# Altium schematic sheet SCHEMATIC.SchDoc
size A
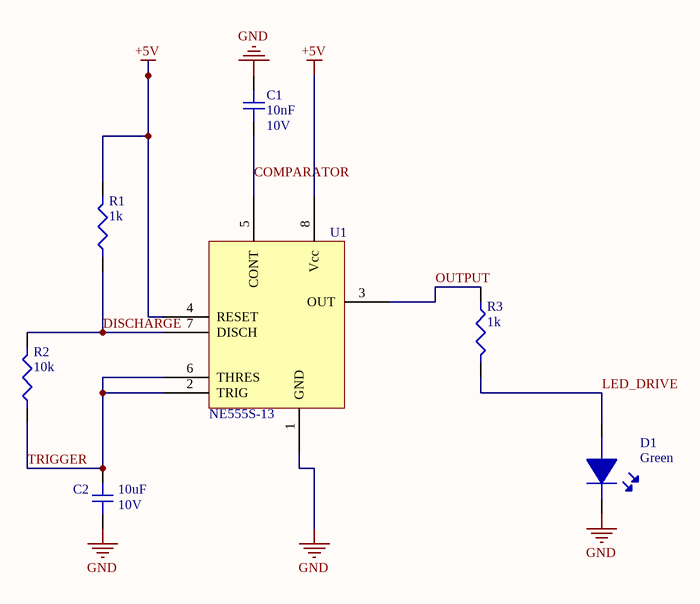
[diagram p0: SCHEMATIC.SchDoc]

## Parts
C1  10nF  Voltage Rating: 10V  [C0603]
C2  10uF  Voltage: 10V  [C0603]
D1  Green  [LED_0603]
R1  1k  [R0603]
R2  10k  [R0603]
R3  1k  [R0603]
U1  NE555S-13  [SOIC8]

## Nets
+5V: R1.2 U1.4(RESET) U1.8(Vcc)
GND: C1.2 C2.2 D1.2 U1.1(GND)
COMPARATOR: C1.1 U1.5(CONT)
DISCHARGE: R1.1 R2.2 U1.7(DISCH)
LED_DRIVE: D1.1 R3.2
OUTPUT: R3.1 U1.3(OUT)
TRIGGER: C2.1 R2.1 U1.2(TRIG) U1.6(THRES)

## Library data of the parts
C1 = CC0603KRX7R6BB103: Cap Ceramic 0.01uF 10V X7R 10% SMD 0603 125C Paper T/R; Manufacturer: Yageo; Supplier 1: Mouser; Manufacturer Part Number: CC0603KRX7R6BB103; Stock 1: 25849; Pricing 1: 1=0.1, 10=0.039, 50=0.039, 100=0.018, 1000=0.014, 10000=0.01 (USD); Mount: Surface Mount; Case/Package: 0603; Min Operating Temperature: -55°C; Max Operating Temperature: 125°C; Capacitance: 10nF; Voltage Rating (DC): 10V; Tolerance: 10%; Packaging: Tape and Reel; Dielectric: X7R; Composition: Ceramic; Length: 0.063inch; Height: 0.8mm; Width: 0.031inch; Thickness: 0.035inch; Depth: 0.8mm; Radiation Hardening: No; Lead Free: Lead Free; Halogen Free: Halogen Free; ComponentLink1URL: http://www.yageo.com/documents/recent/UPY-GPHC_X7R_6.3V-to-50V_8.pdf; ComponentLink1Description: http://www.yageo.com/documents/recent/UPY-GPHC_X7R_6.3V-to-50V_8.pdf; Supplier Part Number 1: 603-CC603KRX7R6BB103
C2 = GRM188R61A106KE69D: Cap Ceramic 10uF 10V X5R 10% SMD 0603 85C Paper T/R; Manufacturer: Murata; Supplier 1: Mouser; Manufacturer Part Number: GRM188R61A106KE69D; Stock 1: 423419; Pricing 1: 1=0.26, 10=0.17, 50=0.17, 100=0.086, 1000=0.052, 10000=0.04 (USD); Mount: Surface Mount; Case/Package: 0603; Case Code (Metric): 1608; Case Code (Imperial): 0603; Min Operating Temperature: -55°C; Max Operating Temperature: 85°C; Capacitance: 10uF; Tolerance: 10%; Packaging: Tape and Reel; Dielectric: X5R; Voltage Rating: 10V; Voltage Rating (DC): 10V; Length: 1.6mm; Height: 0.8mm; Width: 0.031inch; Thickness: 0.037inch; Depth: 0.8mm; REACH SVHC: No SVHC; Lead Free: Lead Free; Supplier Part Number 1: 81-GRM188R61A106KE9D
D1 = LTST-C190GKT: LED GREEN CLEAR 0603 SMD; Manufacturer: Vishay Lite-On; Lens Color: Clear,Colorless; Luminous Intensity: 6mcd; Forward Voltage: 2.1V; Viewing Angle: 130°; Lens Style: Clear,Colorless,Diffused,Rectangular; Forward Current: 30mA; Power Rating: 100mW; Dominant Wavelength: 569nm; Test Current: 10mA; Number of Elements: 1; Wavelength: 565nm; Voltage: 2V; Reverse Voltage: 5V; Current: 1A; Supplier 1: Digi-Key; Manufacturer Part Number: LTST-C190GKT; Stock 1: 2254042; Pricing 1: 1=0.27, 10=0.196, 25=0.1448, 100=0.1034, 250=0.07032, 500=0.06204, 1000=0.0486 (USD); Mount: Surface Mount; Case/Package: 0603; Number of Pins: 2; Color: Green; Case Code (Metric): 1608; Case Code (Imperial): 0603; Min Operating Temperature: -55°C; Max Operating Temperature: 85°C; Package Quantity: 1; Packaging: Tape and Reel; Illumination Color: Green; Lens Transparency: Clear; Power Dissipation: 100mW; Number of LEDs: 1; Length: 1.6mm; Height: 0.8mm; Width: 0.8mm; Depth: 0.8mm; Radiation Hardening: No; Lead Free: Lead Free; ComponentLink1URL: http://uk.rs-online.com/webdocs/0dc0/0900766b80dc02a6.pdf; ComponentLink1Description: http://uk.rs-online.com/webdocs/0dc0/0900766b80dc02a6.pdf; ComponentLink2URL: https://media.digikey.com/pdf/Data%20Sheets/Lite-On%20PDFs/LTST-C190GKT.pdf; ComponentLink2Description: https://media.digikey.com/pdf/Data%20Sheets/Lite-On%20PDFs/LTST-C190GKT.pdf; ComponentLink3URL: http://www1.futureelectronics.com/doc/LITE%20ON/LITE-ON%20LTST-C190GKT.pdf; ComponentLink3Description: http://www1.futureelectronics.com/doc/LITE%20ON/LITE-ON%20LTST-C190GKT.pdf; Supplier Part Number 1: 160-1183-6-ND
R1 R3 = ESR03EZPJ102: RES SMD 1K OHM 5% 1/4W 0603; Manufacturer: Rohm; Resistance: 1kR; Temperature Coefficient: 200ppm/°C; Max Power Dissipation: 250mW; Supplier 1: Future Electronics; Manufacturer Part Number: ESR03EZPJ102; Stock 1: 0; Case/Package: 0603; Case Code (Metric): 1608; Case Code (Imperial): 0603; Min Operating Temperature: -55°C; Max Operating Temperature: 155°C; Tolerance: 5%; Package Quantity: 1; Packaging: Tape and Reel; Composition: Thick Film; Number of Terminations: 2; Features: Automotive AEC-Q200; Length: 0.063inch; Height: 0.022inch; Width: 0.031inch; Lead Free: Lead Free; ComponentLink1URL: https://www.rohm.com/datasheet/ESR01MZPF/esr-e; ComponentLink1Description: https://www.rohm.com/datasheet/ESR01MZPF/esr-e; Supplier Part Number 1: 2103938
R2 = RR0816P-103-D: RES SMD 10K OHM 0.5% 1/16W 0816; Manufacturer: Susumu; Resistance: 10kR; Power Rating: 63mW; Voltage Rating: 75V; Temperature Coefficient: 25ppm/°C; Supplier 1: Arrow; Manufacturer Part Number: RR0816P-103-D; Stock 1: 3511; Pricing 1: 1=0.0837, 10=0.0471, 25=0.0466, 50=0.0459, 100=0.0275, 250=0.0181, 500=0.0179, 1000=0.0177, 3000=0.0166, 6000=0.0155, 15000=0.0145, 30000=0.0134, 75000=0.0123 (USD); Case/Package: 0603; Number of Pins: 2; Weight: 7.1E-05oz; Case Code (Imperial): 0603; Case Code (Metric): 1608; Min Operating Temperature: -55°C; Max Operating Temperature: 125°C; Packaging: Tape and Reel; Tolerance: 0.5%; Package Quantity: 1; Termination: SMD/SMT; Composition: Thin Film; Number of Terminations: 2; Max Power Dissipation: 63mW; Voltage Rating (DC): 75V; Length: 1.6mm; Height: 0.4mm; Width: 0.8mm; Depth: 0.8mm; REACH SVHC: Unknown; Lead Free: Lead Free; ComponentLink1URL: http://documents.rs-components.com/techlib://itc_doclist_GB.htm?stockno=3915321; ComponentLink1Description: http://documents.rs-components.com/techlib://itc_doclist_GB.htm?stockno=3915321; ComponentLink2URL: http://www.susumu.co.jp/common/pdf/n_catalog_partition05_en.pdf; ComponentLink2Description: http://www.susumu.co.jp/common/pdf/n_catalog_partition05_en.pdf; Supplier Part Number 1: RR0816P-103-D
U1 = NE555S-13: 555 Type, Timer/Oscillator (Single) IC 500kHz 8-SOIC (0.154", 3.90mm Width); Manufacturer: Diodes; Max Supply Voltage: 16V; Min Supply Voltage: 4.5V; Operating Supply Current: 13mA; High Level Output Current: -200mA; Low Level Output Current: 200mA; Quiescent Current: 15mA; Number of Timers/Counters: 1; Supplier 1: Digi-Key; Manufacturer Part Number: NE555S-13; Stock 1: 3594; Pricing 1: 1=0.37, 10=0.303, 100=0.206, 500=0.15452, 1000=0.11588 (USD); Mount: Surface Mount; Case/Package: SO; Number of Pins: 8; Weight: 0.01787oz; Contact Plating: Matte,Tin; Min Operating Temperature: 0°C; Max Operating Temperature: 70°C; Packaging: Tape and Reel; Package Quantity: 2500; Frequency: 500kHz; Length: 4.95mm; Height: 1.5mm; Width: 3.95mm; Radiation Hardening: No; Lead Free: Lead Free; REACH SVHC: No SVHC; ComponentLink1URL: https://www.diodes.com/assets/Datasheets/NE555_SA555_NA555.pdf; ComponentLink1Description: https://www.diodes.com/assets/Datasheets/NE555_SA555_NA555.pdf; Supplier Part Number 1: NE555S-13DIDKR-ND